# Altium schematic sheet MCU.SchDoc: MCU
size 279 x 215 mm; Engineer: Ari Wasch; Organization: UW Robotics; Address1: 200 University Avenue; Address2: Waterloo; Address3: Ontario; Address4: Canada N2L 3G6; Revision: 1; SheetNumber: 2; SheetTotal: 3
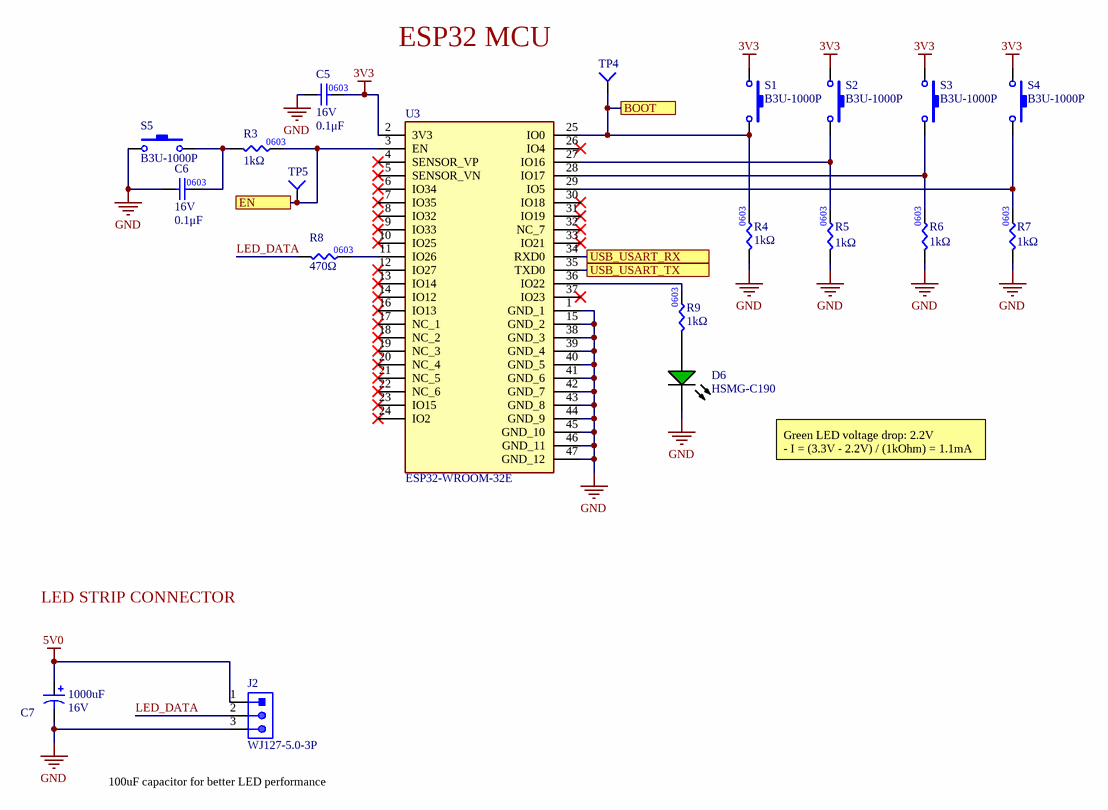
[diagram p0: MCU.SchDoc]

## Parts
C5  value 0.1μF  Voltage Rating: 16V  [CAP0603]  (hidden comment: CAP_0.1uF_16V_0603)
C6  value 0.1μF  Voltage Rating: 16V  [CAP0603]  (hidden comment: CAP_0.1uF_16V_0603)
C7  Voltage: 16V  Capacitance: 1000uF  [CAPAE1030X1050N]  (hidden comment: CAP_1000uF_16V_ALUM)
D6  HSMG-C190  [AVAG-HSMX-C190_V]
J2  WJ127-5.0-3P  [WJ127-5.0-3P]
R3  value 1kΩ  [RES0603]  (hidden comment: RES_1kΩ_0603_5%)
R4  value 1kΩ  [RES0603]  (hidden comment: RES_1kΩ_0603_5%)
R5  value 1kΩ  [RES0603]  (hidden comment: RES_1kΩ_0603_5%)
R6  value 1kΩ  [RES0603]  (hidden comment: RES_1kΩ_0603_5%)
R7  value 1kΩ  [RES0603]  (hidden comment: RES_1kΩ_0603_5%)
R8  value 470Ω  [RESC0603]  (hidden comment: 470R 1%)
R9  value 1kΩ  [RES0603]  (hidden comment: RES_1kΩ_0603_5%)
S1  SW_SPST_NO  [B3U-1000P]  (value not drawn)
S2  SW_SPST_NO  [B3U-1000P]  (value not drawn)
S3  SW_SPST_NO  [B3U-1000P]  (value not drawn)
S4  SW_SPST_NO  [B3U-1000P]  (value not drawn)
S5  SW_SPST_NO  [B3U-1000P]  (value not drawn)
TP4  TESTPOINT_1MM_SQUARE  [TESTPOINT_SQUARE_1MM]  (value not drawn)  (no BOM)
TP5  TESTPOINT_1MM_SQUARE  [TESTPOINT_SQUARE_1MM]  (value not drawn)  (no BOM)
U3  ESP32-WROOM-32E  [ESP32-WROOM-32E]

## Ports
BOOT, EN, USB_USART_RX, USB_USART_TX

## Nets
3V3: C5.2 S1.1 S2.1 S3.1 S4.1 U3.2(3V3)
5V0: C7.1 J2.1
GND: C5.1 C6.1 C7.2 D6.2(K) J2.3 R4.1 R5.1 R6.1 R7.1 S5.1 U3.1(GND_1) U3.15(GND_2) U3.38(GND_3) U3.39(GND_4) U3.40(GND_5) U3.41(GND_6) U3.42(GND_7) U3.43(GND_8) U3.44(GND_9) U3.45(GND_10) U3.46(GND_11) U3.47(GND_12)
BOOT: R4.2 S1.2 TP4.1(=value) U3.25(IO0) ; port BOOT
EN: R3.2 TP5.1(=value) U3.3(EN) ; port EN
LED_DATA: J2.2 R8.1
USB_USART_RX: U3.34(RXD0) ; port USB_USART_RX
USB_USART_TX: U3.35(TXD0) ; port USB_USART_TX
NetC6_2: C6.2 R3.1 S5.2
NetD6_1: D6.1(A) R9.1
NetR5_2: R5.2 S2.2 U3.27(IO16)
NetR6_2: R6.2 S3.2 U3.28(IO17)
NetR7_2: R7.2 S4.2 U3.29(IO5)
NetR8_2: R8.2 U3.11(IO26)
NetR9_2: R9.2 U3.36(IO22)

Not connected (* = marked no-connect by the designer): U3 4(SENSOR_VP)* 5(SENSOR_VN)* 6(IO34)* 7(IO35)* 8(IO32)* 9(IO33)* 10(IO25)* 12(IO27)* 13(IO14)* 14(IO12)* 16(IO13)* 17(NC_1)* 18(NC_2)* 19(NC_3)* 20(NC_4)* 21(NC_5)* 22(NC_6)* 23(IO15)* 24(IO2)* 26(IO4)* 30(IO18)* 31(IO19)* 32(NC_7)* 33(IO21)* 37(IO23)*

## Notes on the sheet
- ESP32 MCU
- Green LED voltage drop: 2.2V
  - I = (3.3V - 2.2V) / (1kOhm) = 1.1mA
- LED STRIP CONNECTOR
- (near J2) 100uF capacitor for better LED performance
- University of Waterloo Robotics Team
- 200 University Ave W
- REV
- PROJECT
- Waterloo, Ontario, Canada
- N2L 3G1
- DOCUMENT
- ENGINEER
- REVIEWER
- MODIFIED
- SHEET
- OF
- (in symbol RES_470Ω_0603_1%) 0603

## Library data of the parts
C5 C6 = CAP_0.1uF_16V_0603: CAP CER 0.1UF 16V X7R 0603; Manufacturer Part Number 1: CC0603KRX7R7BB104; Manufacturer 1: Yageo; Package/Footprint: 0603; Supplier Part Number 1: 311-1088-1-ND; Supplier 1: Digi-Key; Dielectric: X7R; LCSC Number: C108079
C7 = CAP_1000uF_16V_ALUM: CAP ALUM 1000uF 20% 16V SMD; Manufacturer: Lelon; Manufacturer Part Number 1: VE-102M1CTR-1010; Datasheet Link: https://datasheet.lcsc.com/szlcsc/1811051743_Lelon-VE-102M1CTR-1010_C249474.pdf; Height: 10.5mm; LCSC Number: C249474; Tolerance: 20%
D6 = CMP-1744-00002-1: Chip LED, Green, 2.2 V, -40 to 85 degC, 2-Pin SMD, RoHS, Tape and Reel; Frequency: 400 KHz; Max Supply Voltage: 5.5 V; Access Time: 3500 ns; Clock Frequency: 100 KHz; Case\Package: SOIC; Density: 32 kb; Nominal Supply Current: 2 mA; Interface: Serial; Min Supply Voltage: 1.7 V; Packaging: Tape and Reel; PackageReference: HSMX-C190; ComponentLink2URL: http://docs.avagotech.com/docs/AV02-0551EN; RoHSCompliant: true; Pins: 8; REACH SVHC: No SVHC; Max Operating Temperature: 85 degC; Width: 4 mm; Radiation Hardening: No; Package Quantity: 3000; ComponentLink3Description: Package Specification; ComponentLink1Description: Manufacturer URL; Min Operating Temperature: -40 degC; PackageDescription: 2-Pin Surface Mount Device, Body 1.6 x 0.8 mm, Height 0.9 mm; Max Clock Frequency: 100 KHz; Height: 1.5 mm; ComponentLink1URL: http://www.avagotech.com/; DatasheetVersion: Mar-12; ComponentLink2Description: Datasheet; Mount: Surface Mount; Length: 5 mm; ComponentLink3URL: http://www.fairchildsemi.com/dwg/MA/MA03D.pdf; LCSC Number: C188729
J2 = WJ127-5.0-3P: Manufacturer 1: Ningbo Kangnex; LCSC Number: C8393; Manufaturer Part Number 1: WJ127-5.0-3P; Datasheet: https://datasheet.lcsc.com/lcsc/2107141401_Ningbo-Kangnex-Elec-WJ127-5-0-3P_C8393.pdf; Supplier 1: LCSC
R3-R7 R9 = RES_1kΩ_0603_5%: RES 1K OHM 5% 1/10W 0603; Manufacturer 1: Yageo; Manufacturer Part Number 1: RC0603JR-071KL; Package/Footprint: 0603; Supplier Part Number 1: 311-1.0KGRCT-ND; Supplier 1: Digi-Key; Mounting Type: SMD; LCSC Number: C14676
R8 = RES_470Ω_0603_1%: RES 470 OHM 1% 1/10W 0603; Manufacturer 1: Yageo; Manufacturer Part Number 1: AC0603FR-07470RL; Supplier Part Number 1: 311-470LDCT-ND; Supplier 1: Digi-Key; LCSC Number: C144657
S1-S5 = SW_SPST_NO: SWITCH TACTILE SPST-NO 0.05A 12V; Manufacturer 1: Omron Electronics Inc-EMC Div; Package/Footprint: SMD; Manufacturer Part Number 1: B3U-1000P; Supplier 1: Digi-Key; Supplier Part Number 1: SW1020CT-ND; Mounting Type: SMD; LCSC Number: C231329
TP4 TP5 = TESTPOINT_1MM_SQUARE: TESTPOINT 1MM SQUARE
U3 = ESP32-WROOM-32E: Parameter 1: *; Supplier 1: Digi-Key; Supplier Part Number 1: 1965-ESP32-WROOM-32E(16MB)CT-ND; LCSC Number: C529581